# Altium schematic sheet PWMDriver.SchDoc
size A4; SPICEModelCacheEKQLMBQO: <root> / <DocumentId>EKQLMBQO</DocumentId> / </root>
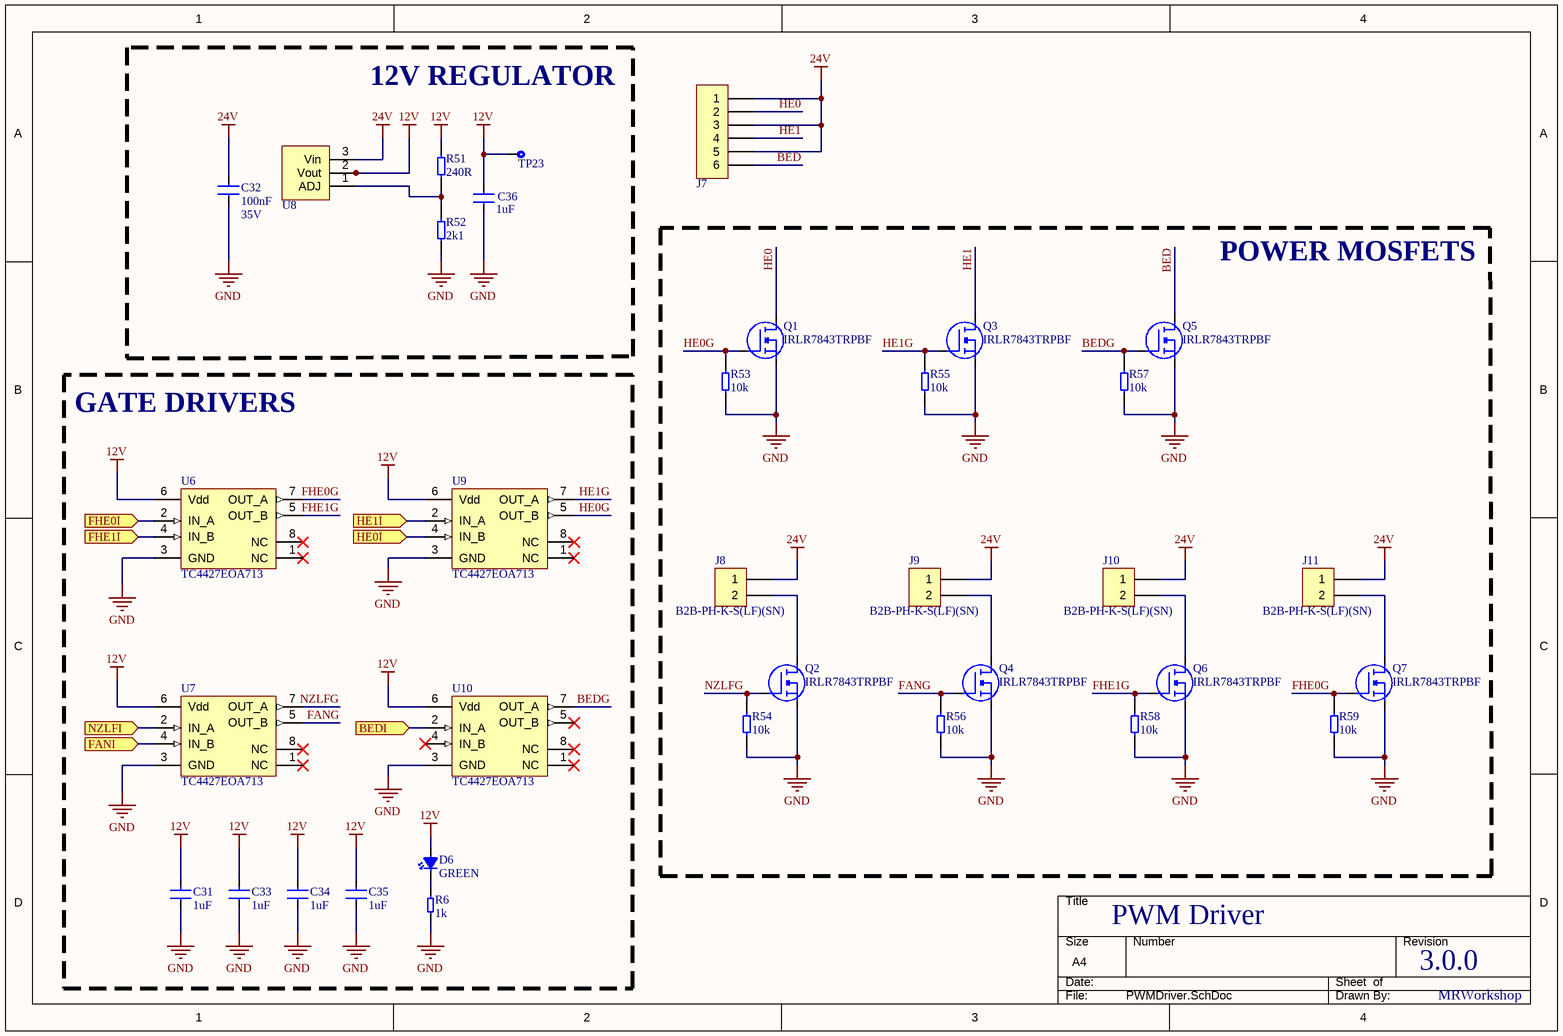
[diagram p0: PWMDriver.SchDoc]

## Parts
C31  value 1uF  [C_0402]  (hidden comment: TMK105BJ105MV-F)
C32  value 100nF  Voltage: 35V  [C_0402]  (hidden comment: GMK105BJ104KV-F)
C33  value 1uF  [C_0402]  (hidden comment: TMK105BJ105MV-F)
C34  value 1uF  [C_0402]  (hidden comment: TMK105BJ105MV-F)
C35  value 1uF  [C_0402]  (hidden comment: TMK105BJ105MV-F)
C36  value 1uF  [C_0402]  (hidden comment: TMK105BJ105MV-F)
D6  GREEN  [LED_0402]
J7  TB004-750-06GR  [TB004-750-06GR]  (value not drawn)
J8  B2B-PH-K-S(LF)(SN)  [B2B-PH-K-S(LF)(SN)]
J9  B2B-PH-K-S(LF)(SN)  [B2B-PH-K-S(LF)(SN)]
J10  B2B-PH-K-S(LF)(SN)  [B2B-PH-K-S(LF)(SN)]
J11  B2B-PH-K-S(LF)(SN)  [B2B-PH-K-S(LF)(SN)]
Q1  IRLR7843TRPBF  [DPAK-6.2x6.7]
Q2  IRLR7843TRPBF  [DPAK-6.2x6.7]
Q3  IRLR7843TRPBF  [DPAK-6.2x6.7]
Q4  IRLR7843TRPBF  [DPAK-6.2x6.7]
Q5  IRLR7843TRPBF  [DPAK-6.2x6.7]
Q6  IRLR7843TRPBF  [DPAK-6.2x6.7]
Q7  IRLR7843TRPBF  [DPAK-6.2x6.7]
R6  value 1k  [R_0402]  (hidden comment: CR0402-FX-1001GLF)
R51  value 240R  [R_0402]  (hidden comment: CR0402-FX-2400GLF)
R52  value 2k1  [R_0402]  (hidden comment: CR0402-FX-2101GLF)
R53  value 10k  [R_0402]  (hidden comment: CR0402-FX-1002GLF)
R54  value 10k  [R_0402]  (hidden comment: CR0402-FX-1002GLF)
R55  value 10k  [R_0402]  (hidden comment: CR0402-FX-1002GLF)
R56  value 10k  [R_0402]  (hidden comment: CR0402-FX-1002GLF)
R57  value 10k  [R_0402]  (hidden comment: CR0402-FX-1002GLF)
R58  value 10k  [R_0402]  (hidden comment: CR0402-FX-1002GLF)
R59  value 10k  [R_0402]  (hidden comment: CR0402-FX-1002GLF)
TP23  TestPoint_1mm  [TestPoint_1mm]  (value not drawn)
U6  TC4427EOA713  [SOIC8]
U7  TC4427EOA713  [SOIC8]
U8  LM317MBSTT3G  [SOT-223]  (value not drawn)
U9  TC4427EOA713  [SOIC8]
U10  TC4427EOA713  [SOIC8]

## Blocks framed on the sheet
12V REGULATOR: C32 C36 R51 R52 TP23 U8
POWER MOSFETS: J8-J11 Q1-Q7 R53-R59
GATE DRIVERS: C31 C33-C35 D6 R6 U6 U7 U9 U10

## Ports
BEDI (in), FANI (in), FHE0I (in), FHE1I (in), HE0I (in), HE1I (in), NZLFI (in)

## Nets
12V: C31.2 C33.2 C34.2 C35.2 C36.2 D6.2 R51.2 TP23.1 U6.6(Vdd) U7.6(Vdd) U8.2(Vout) U8.4(Vout) U9.6(Vdd) U10.6(Vdd)
24V: C32.2 J7.1 J7.3 J7.5 J8.1 J9.1 J10.1 J11.1 U8.3(Vin)
GND: C31.1 C32.1 C33.1 C34.1 C35.1 C36.1 Q1.3(S) Q2.3(S) Q3.3(S) Q4.3(S) Q5.3(S) Q6.3(S) Q7.3(S) R6.1 R52.1 R53.1 R54.1 R55.1 R56.1 R57.1 R58.1 R59.1 U6.3(GND) U7.3(GND) U9.3(GND) U10.3(GND)
BED: J7.6 Q5.4(D)
BEDG: Q5.1(G) R57.2 U10.7(OUT_A)
BEDI: U10.2(IN_A) ; port BEDI
FANG: Q4.1(G) R56.2 U7.5(OUT_B)
FANI: U7.4(IN_B) ; port FANI
FHE0G: Q7.1(G) R59.2 U6.7(OUT_A)
FHE0I: U6.2(IN_A) ; port FHE0I
FHE1G: Q6.1(G) R58.2 U6.5(OUT_B)
FHE1I: U6.4(IN_B) ; port FHE1I
HE0: J7.2 Q1.4(D)
HE0G: Q1.1(G) R53.2 U9.5(OUT_B)
HE0I: U9.4(IN_B) ; port HE0I
HE1: J7.4 Q3.4(D)
HE1G: Q3.1(G) R55.2 U9.7(OUT_A)
HE1I: U9.2(IN_A) ; port HE1I
NZLFG: Q2.1(G) R54.2 U7.7(OUT_A)
NZLFI: U7.2(IN_A) ; port NZLFI
NetD6_1: D6.1 R6.2
NetJ8_2: J8.2 Q2.4(D)
NetJ9_2: J9.2 Q4.4(D)
NetJ10_2: J10.2 Q6.4(D)
NetJ11_2: J11.2 Q7.4(D)
NetR51_1: R51.1 R52.2 U8.1(ADJ)

Not connected (* = marked no-connect by the designer): U6 1(NC)* 8(NC)*; U7 1(NC)* 8(NC)*; U9 1(NC)* 8(NC)*; U10 1(NC)* 4(IN_B)* 5(OUT_B)* 8(NC)*

## Notes on the sheet
- PWM Driver
- 3.0.0
- MRWorkshop
- THIS DOCUMENT AND THE DATA DISCLOSED HEREIN OR
- HEREWITH IS THE PROPERTY OF ALTIUM LIMITED AND MAY
- DWG NO:
- REVISION
- REV:
- DESCRIPTION
- DATE
- APPROVED
- BE FREELY DISTRIBUTED IN WHOLE. NO RIGHTS ARE
- RESERVED OR EXPRESS OR IMPLIED WARANTEE GIVEN.
- ENG:
- APPROVALS
- PROJECT
- DSN:
- CHK:
- REFERENCE DOCUMENTS
- PROJECT REVISION:
- TITLE
- DOCUMENT REVISION:
- DESIGN ITEM:
- BOM:
- FAB DWG:
- PCB DWG:
- ASSY DWG:
- SCALE:
- A3
- SIZE
- CAGE CODE
- FILE NAME
- DWG NO.
- SHEET
- OF
- REV

## Library data of the parts
C31 C33-C36 = TMK105BJ105MV-F: Multilayer Ceramic Capacitors MLCC - SMD/SMT 963-MSAST105SB5105MF RPLCMT PN 25V 1uF X5R 0402 20%; Voltage: 25V; Supplier 1: Digikey; Supplier Part Number 1: 587-3245-1-ND
C32 = GMK105BJ104KV-F: Multilayer Ceramic Capacitors MLCC - SMD/SMT 963-MSASG105SB5104KF RPLCMT PN 35V 0.1uF X5R 0402 10%; Supplier 1: Digikey; Supplier Part Number 1: 587-1994-1-ND
D6 = APHHS1005CGCK: Single Colour LEDs GREEN WTR CLEAR 40mcd 574nm; Supplier 1: Digikey; Supplier Part Number 1: 754-1101-1-ND
J7 = TB004-750-06GR: Fixed Terminal Blocks 6 Poles, Screw Type, Horizontal, 7.50 mm Pitch, 24-12 (AWG)
J8-J11 = B2B-PH-K-S(LF)(SN): Headers & Wire Housings PH SHROUDED HEADER; Supplier 1: Rs; Supplier Part Number 1: 8201422P
Q1-Q7 = IRLR7843TRPBF: MOSFETs 30V 1 N-CH HEXFET 3.3mOhms 34nC; Supplier 1: Farnell; Supplier Part Number 1: 2468059
R6 = CR0402-FX-1001GLF: Thick Film Resistors - SMD 1.0K OHM 1%; Power: 62.5mW; Supplier 1: Rs; Supplier Part Number 1: 2231667; Tolerance: 1%
R51 = CR0402-FX-2400GLF: Thick Film Resistors - SMD 240 OHM 1%
R52 = CR0402-FX-2101GLF: Thick Film Resistors - SMD 2.1KOHM 1/16WATT 1%; Power: 62.5mW; Supplier 1: Farnell; Supplier Part Number 1: 4059707
R53-R59 = CR0402-FX-1002GLF: Thick Film Resistors - SMD 10K OHM 1%; Supplier 1: Farnell; Supplier Part Number 1: 2333566
U6 U7 U9 U10 = TC4427EOA713: Gate Drivers 1.5A Dual
U8 = LM317MBSTT3G: Linear Voltage Regulators 500mA ADJ 1.2-37V Positive; Supplier 1: Farnell; Supplier Part Number 1: 1652292